# Altium schematic sheet Sheet2.SchDoc
size 594 x 420 mm; SheetNumber: 1; SheetTotal: 1
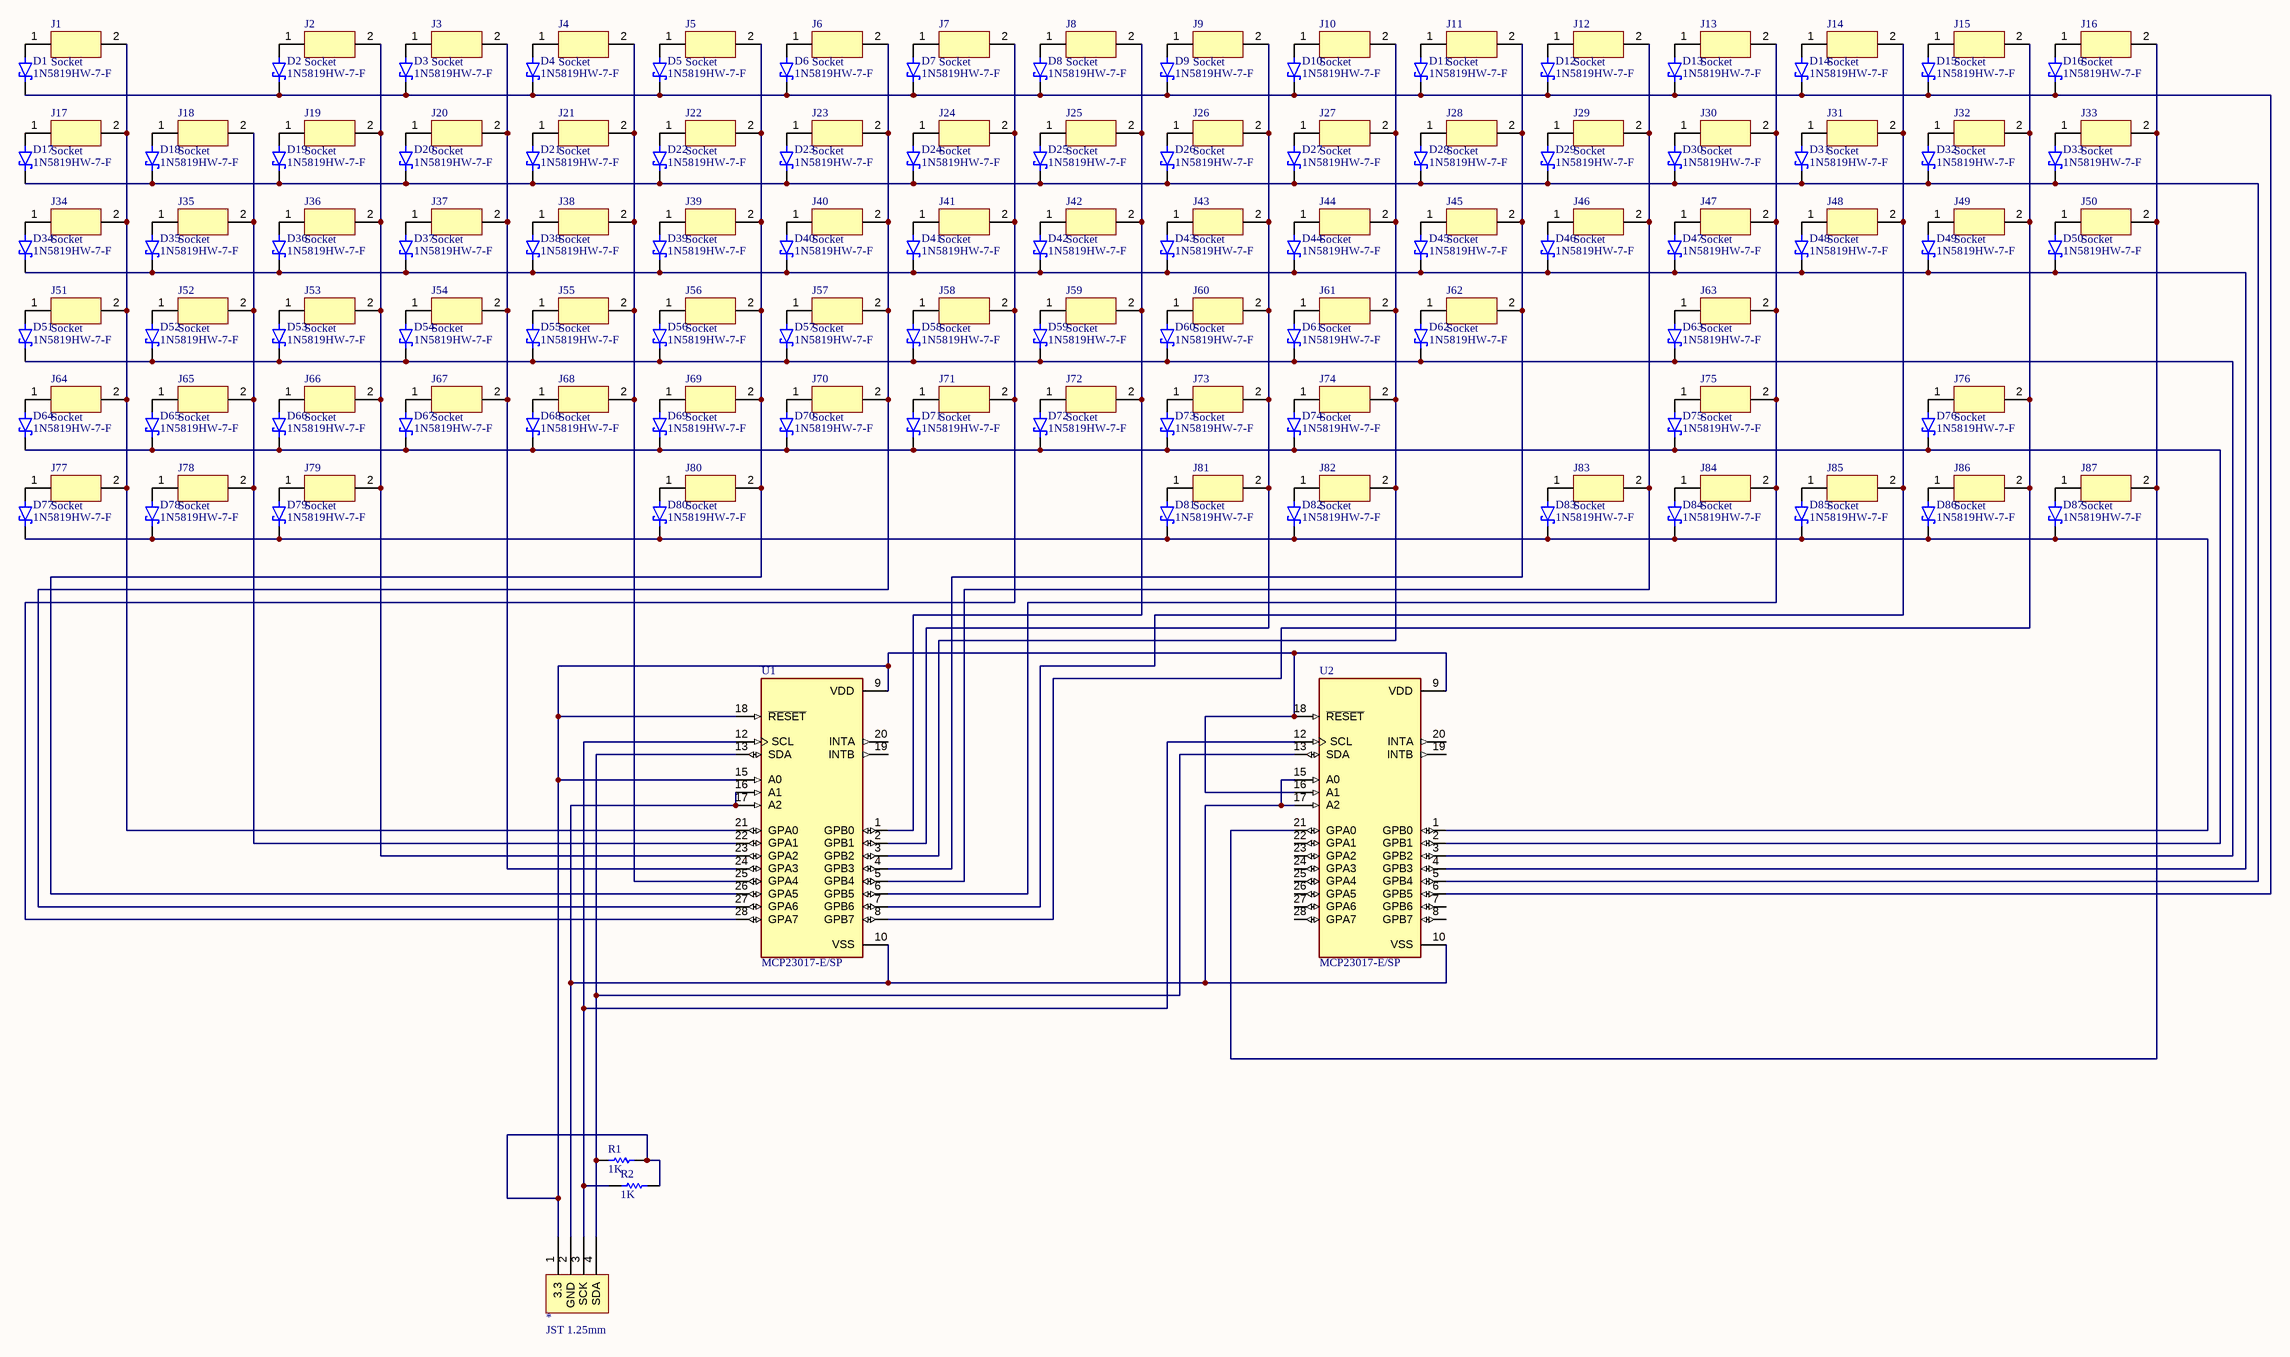
[diagram p0: Sheet2.SchDoc]

## Parts
*  JST 1.25mm  [JST]
D1  1N5819HW-7-F  [SOD3715X145N]
D2  1N5819HW-7-F  [SOD3715X145N]
D3  1N5819HW-7-F  [SOD3715X145N]
D4  1N5819HW-7-F  [SOD3715X145N]
D5  1N5819HW-7-F  [SOD3715X145N]
D6  1N5819HW-7-F  [SOD3715X145N]
D7  1N5819HW-7-F  [SOD3715X145N]
D8  1N5819HW-7-F  [SOD3715X145N]
D9  1N5819HW-7-F  [SOD3715X145N]
D10  1N5819HW-7-F  [SOD3715X145N]
D11  1N5819HW-7-F  [SOD3715X145N]
D12  1N5819HW-7-F  [SOD3715X145N]
D13  1N5819HW-7-F  [SOD3715X145N]
D14  1N5819HW-7-F  [SOD3715X145N]
D15  1N5819HW-7-F  [SOD3715X145N]
D16  1N5819HW-7-F  [SOD3715X145N]
D17  1N5819HW-7-F  [SOD3715X145N]
D18  1N5819HW-7-F  [SOD3715X145N]
D19  1N5819HW-7-F  [SOD3715X145N]
D20  1N5819HW-7-F  [SOD3715X145N]
D21  1N5819HW-7-F  [SOD3715X145N]
D22  1N5819HW-7-F  [SOD3715X145N]
D23  1N5819HW-7-F  [SOD3715X145N]
D24  1N5819HW-7-F  [SOD3715X145N]
D25  1N5819HW-7-F  [SOD3715X145N]
D26  1N5819HW-7-F  [SOD3715X145N]
D27  1N5819HW-7-F  [SOD3715X145N]
D28  1N5819HW-7-F  [SOD3715X145N]
D29  1N5819HW-7-F  [SOD3715X145N]
D30  1N5819HW-7-F  [SOD3715X145N]
D31  1N5819HW-7-F  [SOD3715X145N]
D32  1N5819HW-7-F  [SOD3715X145N]
D33  1N5819HW-7-F  [SOD3715X145N]
D34  1N5819HW-7-F  [SOD3715X145N]
D35  1N5819HW-7-F  [SOD3715X145N]
D36  1N5819HW-7-F  [SOD3715X145N]
D37  1N5819HW-7-F  [SOD3715X145N]
D38  1N5819HW-7-F  [SOD3715X145N]
D39  1N5819HW-7-F  [SOD3715X145N]
D40  1N5819HW-7-F  [SOD3715X145N]
D41  1N5819HW-7-F  [SOD3715X145N]
D42  1N5819HW-7-F  [SOD3715X145N]
D43  1N5819HW-7-F  [SOD3715X145N]
D44  1N5819HW-7-F  [SOD3715X145N]
D45  1N5819HW-7-F  [SOD3715X145N]
D46  1N5819HW-7-F  [SOD3715X145N]
D47  1N5819HW-7-F  [SOD3715X145N]
D48  1N5819HW-7-F  [SOD3715X145N]
D49  1N5819HW-7-F  [SOD3715X145N]
D50  1N5819HW-7-F  [SOD3715X145N]
D51  1N5819HW-7-F  [SOD3715X145N]
D52  1N5819HW-7-F  [SOD3715X145N]
D53  1N5819HW-7-F  [SOD3715X145N]
D54  1N5819HW-7-F  [SOD3715X145N]
D55  1N5819HW-7-F  [SOD3715X145N]
D56  1N5819HW-7-F  [SOD3715X145N]
D57  1N5819HW-7-F  [SOD3715X145N]
D58  1N5819HW-7-F  [SOD3715X145N]
D59  1N5819HW-7-F  [SOD3715X145N]
D60  1N5819HW-7-F  [SOD3715X145N]
D61  1N5819HW-7-F  [SOD3715X145N]
D62  1N5819HW-7-F  [SOD3715X145N]
D63  1N5819HW-7-F  [SOD3715X145N]
D64  1N5819HW-7-F  [SOD3715X145N]
D65  1N5819HW-7-F  [SOD3715X145N]
D66  1N5819HW-7-F  [SOD3715X145N]
D67  1N5819HW-7-F  [SOD3715X145N]
D68  1N5819HW-7-F  [SOD3715X145N]
D69  1N5819HW-7-F  [SOD3715X145N]
D70  1N5819HW-7-F  [SOD3715X145N]
D71  1N5819HW-7-F  [SOD3715X145N]
D72  1N5819HW-7-F  [SOD3715X145N]
D73  1N5819HW-7-F  [SOD3715X145N]
D74  1N5819HW-7-F  [SOD3715X145N]
D75  1N5819HW-7-F  [SOD3715X145N]
D76  1N5819HW-7-F  [SOD3715X145N]
D77  1N5819HW-7-F  [SOD3715X145N]
D78  1N5819HW-7-F  [SOD3715X145N]
D79  1N5819HW-7-F  [SOD3715X145N]
D80  1N5819HW-7-F  [SOD3715X145N]
D81  1N5819HW-7-F  [SOD3715X145N]
D82  1N5819HW-7-F  [SOD3715X145N]
D83  1N5819HW-7-F  [SOD3715X145N]
D84  1N5819HW-7-F  [SOD3715X145N]
D85  1N5819HW-7-F  [SOD3715X145N]
D86  1N5819HW-7-F  [SOD3715X145N]
D87  1N5819HW-7-F  [SOD3715X145N]
J1  Socket  [SOCKET]
J2  Socket  [SOCKET]
J3  Socket  [SOCKET]
J4  Socket  [SOCKET]
J5  Socket  [SOCKET]
J6  Socket  [SOCKET]
J7  Socket  [SOCKET]
J8  Socket  [SOCKET]
J9  Socket  [SOCKET]
J10  Socket  [SOCKET]
J11  Socket  [SOCKET]
J12  Socket  [SOCKET]
J13  Socket  [SOCKET]
J14  Socket  [SOCKET]
J15  Socket  [SOCKET]
J16  Socket  [SOCKET]
J17  Socket  [SOCKET]
J18  Socket  [SOCKET]
J19  Socket  [SOCKET]
J20  Socket  [SOCKET]
J21  Socket  [SOCKET]
J22  Socket  [SOCKET]
J23  Socket  [SOCKET]
J24  Socket  [SOCKET]
J25  Socket  [SOCKET]
J26  Socket  [SOCKET]
J27  Socket  [SOCKET]
J28  Socket  [SOCKET]
J29  Socket  [SOCKET]
J30  Socket  [SOCKET]
J31  Socket  [SOCKET]
J32  Socket  [SOCKET]
J33  Socket  [SOCKET]
J34  Socket  [SOCKET]
J35  Socket  [SOCKET]
J36  Socket  [SOCKET]
J37  Socket  [SOCKET]
J38  Socket  [SOCKET]
J39  Socket  [SOCKET]
J40  Socket  [SOCKET]
J41  Socket  [SOCKET]
J42  Socket  [SOCKET]
J43  Socket  [SOCKET]
J44  Socket  [SOCKET]
J45  Socket  [SOCKET]
J46  Socket  [SOCKET]
J47  Socket  [SOCKET]
J48  Socket  [SOCKET]
J49  Socket  [SOCKET]
J50  Socket  [SOCKET]
J51  Socket  [SOCKET]
J52  Socket  [SOCKET]
J53  Socket  [SOCKET]
J54  Socket  [SOCKET]
J55  Socket  [SOCKET]
J56  Socket  [SOCKET]
J57  Socket  [SOCKET]
J58  Socket  [SOCKET]
J59  Socket  [SOCKET]
J60  Socket  [SOCKET]
J61  Socket  [SOCKET]
J62  Socket  [SOCKET]
J63  Socket  [SOCKET]
J64  Socket  [SOCKET]
J65  Socket  [SOCKET]
J66  Socket  [SOCKET]
J67  Socket  [SOCKET]
J68  Socket  [SOCKET]
J69  Socket  [SOCKET]
J70  Socket  [SOCKET]
J71  Socket  [SOCKET]
J72  Socket  [SOCKET]
J73  Socket  [SOCKET]
J74  Socket  [SOCKET]
J75  Socket  [SOCKET]
J76  Socket  [SOCKET]
J77  Socket  [SOCKET]
J78  Socket  [SOCKET]
J79  Socket  [SOCKET]
J80  Socket  [SOCKET]
J81  Socket  [SOCKET]
J82  Socket  [SOCKET]
J83  Socket  [SOCKET]
J84  Socket  [SOCKET]
J85  Socket  [SOCKET]
J86  Socket  [SOCKET]
J87  Socket  [SOCKET]
R1  value 1K  (hidden comment: Resistor)
R2  value 1K  (hidden comment: Resistor)
U1  MCP23017-E/SP  [DIP787W45P254L3556H508Q28]
U2  MCP23017-E/SP  [DIP787W45P254L3556H508Q28]

## Nets
Net*_1: *.1(3.3) R1.2 R2.2 U1.9(VDD) U1.15(A0) U1.18(~{RESET}) U2.9(VDD) U2.16(A1) U2.18(~{RESET})
Net*_2: *.2(GND) U1.10(VSS) U1.16(A1) U1.17(A2) U2.10(VSS) U2.15(A0) U2.17(A2)
Net*_3: *.3(SCK) R2.1 U1.12(SCL) U2.12(SCL)
Net*_4: *.4(SDA) R1.1 U1.13(SDA) U2.13(SDA)
NetD1_A: D1.A J1.1
NetD1_C: D1.C(K) D2.C(K) D3.C(K) D4.C(K) D5.C(K) D6.C(K) D7.C(K) D8.C(K) D9.C(K) D10.C(K) D11.C(K) D12.C(K) D13.C(K) D14.C(K) D15.C(K) D16.C(K) U2.6(GPB5)
NetD2_A: D2.A J2.1
NetD3_A: D3.A J3.1
NetD4_A: D4.A J4.1
NetD5_A: D5.A J5.1
NetD6_A: D6.A J6.1
NetD7_A: D7.A J7.1
NetD8_A: D8.A J8.1
NetD9_A: D9.A J9.1
NetD10_A: D10.A J10.1
NetD11_A: D11.A J11.1
NetD12_A: D12.A J12.1
NetD13_A: D13.A J13.1
NetD14_A: D14.A J14.1
NetD15_A: D15.A J15.1
NetD16_A: D16.A J16.1
NetD17_A: D17.A J17.1
NetD17_C: D17.C(K) D18.C(K) D19.C(K) D20.C(K) D21.C(K) D22.C(K) D23.C(K) D24.C(K) D25.C(K) D26.C(K) D27.C(K) D28.C(K) D29.C(K) D30.C(K) D31.C(K) D32.C(K) D33.C(K) U2.5(GPB4)
NetD18_A: D18.A J18.1
NetD19_A: D19.A J19.1
NetD20_A: D20.A J20.1
NetD21_A: D21.A J21.1
NetD22_A: D22.A J22.1
NetD23_A: D23.A J23.1
NetD24_A: D24.A J24.1
NetD25_A: D25.A J25.1
NetD26_A: D26.A J26.1
NetD27_A: D27.A J27.1
NetD28_A: D28.A J28.1
NetD29_A: D29.A J29.1
NetD30_A: D30.A J30.1
NetD31_A: D31.A J31.1
NetD32_A: D32.A J32.1
NetD33_A: D33.A J33.1
NetD34_A: D34.A J34.1
NetD34_C: D34.C(K) D35.C(K) D36.C(K) D37.C(K) D38.C(K) D39.C(K) D40.C(K) D41.C(K) D42.C(K) D43.C(K) D44.C(K) D45.C(K) D46.C(K) D47.C(K) D48.C(K) D49.C(K) D50.C(K) U2.4(GPB3)
NetD35_A: D35.A J35.1
NetD36_A: D36.A J36.1
NetD37_A: D37.A J37.1
NetD38_A: D38.A J38.1
NetD39_A: D39.A J39.1
NetD40_A: D40.A J40.1
NetD41_A: D41.A J41.1
NetD42_A: D42.A J42.1
NetD43_A: D43.A J43.1
NetD44_A: D44.A J44.1
NetD45_A: D45.A J45.1
NetD46_A: D46.A J46.1
NetD47_A: D47.A J47.1
NetD48_A: D48.A J48.1
NetD49_A: D49.A J49.1
NetD50_A: D50.A J50.1
NetD51_A: D51.A J51.1
NetD51_C: D51.C(K) D52.C(K) D53.C(K) D54.C(K) D55.C(K) D56.C(K) D57.C(K) D58.C(K) D59.C(K) D60.C(K) D61.C(K) D62.C(K) D63.C(K) U2.3(GPB2)
NetD52_A: D52.A J52.1
NetD53_A: D53.A J53.1
NetD54_A: D54.A J54.1
NetD55_A: D55.A J55.1
NetD56_A: D56.A J56.1
NetD57_A: D57.A J57.1
NetD58_A: D58.A J58.1
NetD59_A: D59.A J59.1
NetD60_A: D60.A J60.1
NetD61_A: D61.A J61.1
NetD62_A: D62.A J62.1
NetD63_A: D63.A J63.1
NetD64_A: D64.A J64.1
NetD64_C: D64.C(K) D65.C(K) D66.C(K) D67.C(K) D68.C(K) D69.C(K) D70.C(K) D71.C(K) D72.C(K) D73.C(K) D74.C(K) D75.C(K) D76.C(K) U2.2(GPB1)
NetD65_A: D65.A J65.1
NetD66_A: D66.A J66.1
NetD67_A: D67.A J67.1
NetD68_A: D68.A J68.1
NetD69_A: D69.A J69.1
NetD70_A: D70.A J70.1
NetD71_A: D71.A J71.1
NetD72_A: D72.A J72.1
NetD73_A: D73.A J73.1
NetD74_A: D74.A J74.1
NetD75_A: D75.A J75.1
NetD76_A: D76.A J76.1
NetD77_A: D77.A J77.1
NetD77_C: D77.C(K) D78.C(K) D79.C(K) D80.C(K) D81.C(K) D82.C(K) D83.C(K) D84.C(K) D85.C(K) D86.C(K) D87.C(K) U2.1(GPB0)
NetD78_A: D78.A J78.1
NetD79_A: D79.A J79.1
NetD80_A: D80.A J80.1
NetD81_A: D81.A J81.1
NetD82_A: D82.A J82.1
NetD83_A: D83.A J83.1
NetD84_A: D84.A J84.1
NetD85_A: D85.A J85.1
NetD86_A: D86.A J86.1
NetD87_A: D87.A J87.1
NetJ1_2: J1.2 J17.2 J34.2 J51.2 J64.2 J77.2 U1.21(GPA0)
NetJ2_2: J2.2 J19.2 J36.2 J53.2 J66.2 J79.2 U1.23(GPA2)
NetJ3_2: J3.2 J20.2 J37.2 J54.2 J67.2 U1.24(GPA3)
NetJ4_2: J4.2 J21.2 J38.2 J55.2 J68.2 U1.25(GPA4)
NetJ5_2: J5.2 J22.2 J39.2 J56.2 J69.2 J80.2 U1.26(GPA5)
NetJ6_2: J6.2 J23.2 J40.2 J57.2 J70.2 U1.27(GPA6)
NetJ7_2: J7.2 J24.2 J41.2 J58.2 J71.2 U1.28(GPA7)
NetJ8_2: J8.2 J25.2 J42.2 J59.2 J72.2 U1.1(GPB0)
NetJ9_2: J9.2 J26.2 J43.2 J60.2 J73.2 J81.2 U1.2(GPB1)
NetJ10_2: J10.2 J27.2 J44.2 J61.2 J74.2 J82.2 U1.3(GPB2)
NetJ11_2: J11.2 J28.2 J45.2 J62.2 U1.4(GPB3)
NetJ12_2: J12.2 J29.2 J46.2 J83.2 U1.5(GPB4)
NetJ13_2: J13.2 J30.2 J47.2 J63.2 J75.2 J84.2 U1.6(GPB5)
NetJ14_2: J14.2 J31.2 J48.2 J85.2 U1.7(GPB6)
NetJ15_2: J15.2 J32.2 J49.2 J76.2 J86.2 U1.8(GPB7)
NetJ16_2: J16.2 J33.2 J50.2 J87.2 U2.21(GPA0)
NetJ18_2: J18.2 J35.2 J52.2 J65.2 J78.2 U1.22(GPA1)

Not connected (* = marked no-connect by the designer): U1 19(INTB) 20(INTA); U2 7(GPB6) 8(GPB7) 19(INTB) 20(INTA) 22(GPA1) 23(GPA2) 24(GPA3) 25(GPA4) 26(GPA5) 27(GPA6) 28(GPA7)

## Notes on the sheet
- DWG NO:
- REV:
- THIS DOCUMENT AND THE DATA DISCLOSED HEREIN OR
- HEREWITH IS THE PROPERTY OF ALTIUM LIMITED AND MAY
- BE FREELY DISTRIBUTED IN WHOLE. NO RIGHTS ARE
- RESERVED OR EXPRESS OR IMPLIED WARANTEE GIVEN.
- REVISION
- DESCRIPTION
- DATE
- APPROVED
- ENG:
- APPROVALS
- PROJECT
- DSN:
- CHK:
- REFERENCE DOCUMENTS
- PROJECT REVISION:
- TITLE
- DOCUMENT REVISION:
- DESIGN ITEM:
- BOM:
- FAB DWG:
- PCB DWG:
- ASSY DWG:
- SCALE:
- A2
- SIZE
- CAGE CODE
- FILE NAME
- DWG NO.
- SHEET
- OF
- REV

## Library data of the parts
D1-D87 = 1N5819HW-7-F: Diode Schottky 40 V 1A Surface Mount SOD-123; MF: Diodes Inc.; Value: *; SnapEDA_Link: https://www.snapeda.com/parts/1N5819HW-7-F/Diodes+Inc./view-part/?ref=snap; Purchase-URL: https://pricing.snapeda.com/search/part/1N5819HW-7-F/?ref=eda; Availability: In Stock; Price: None; Package: SOD-123 Fairchild Semiconductor; Check_prices: https://www.snapeda.com/parts/1N5819HW-7-F/Diodes+Inc./view-part/?ref=eda; MP: 1N5819HW-7-F
J1-J87 = CPG151101S11: Kailh hotswap socket
R1 R2 = Resistor: TC1: 0; SimulationGenericComponent: True; TC2: 0
U1 U2 = MCP23017-E/SP: I/O Expander 16 IÂ²C 1.7 MHz 28-SPDIP; MF: Microchip; Purchase-URL: https://pricing.snapeda.com/search/part/MCP23017-E/SP/?ref=eda; Price: None; SnapEDA_Link: https://www.snapeda.com/parts/MCP23017-E/SP/Microchip/view-part/?ref=snap; Check_prices: https://www.snapeda.com/parts/MCP23017-E/SP/Microchip/view-part/?ref=eda; Package: DIP-28 Microchip; Availability: In Stock; Value: *; MP: MCP23017-E/SP